# EasyEDA schematic H bridge core design.json
TITLE: H Bridge; REV: 1.0; Date: 2025-10-21; Sheet: 1/1; Drawn By: Sanmitra Goswami; Company: -
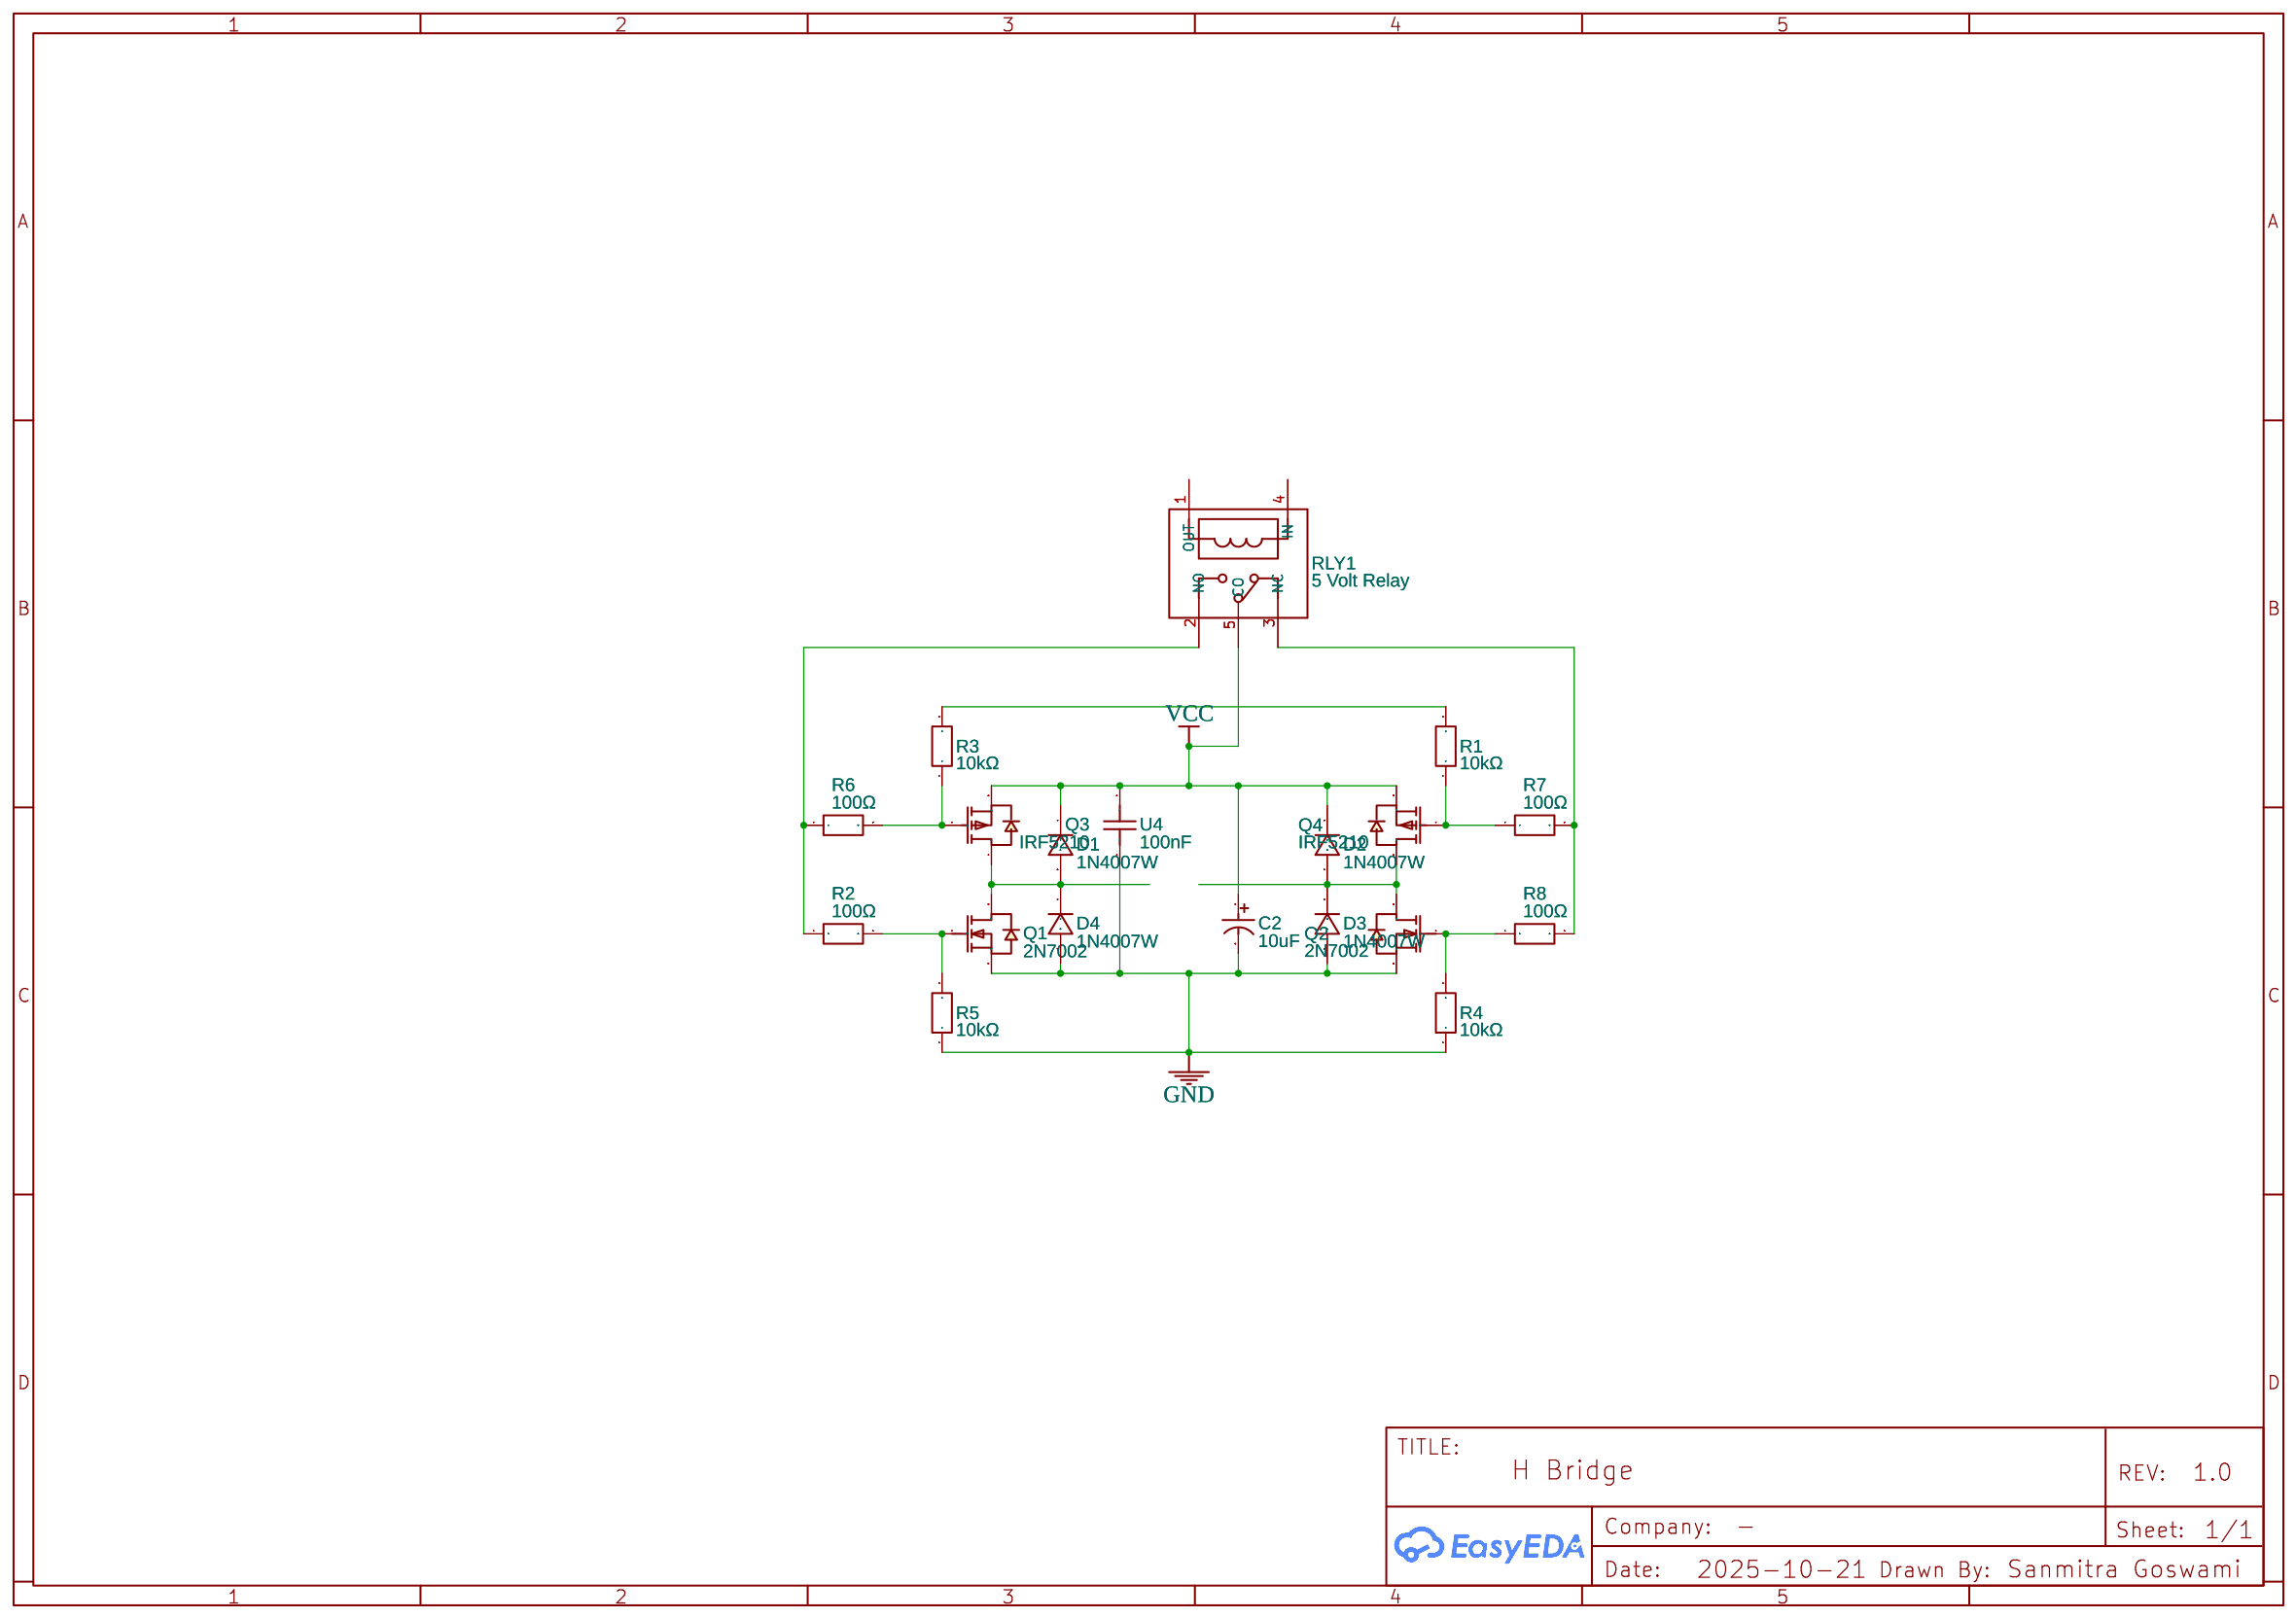
[diagram p0: schematic sheet]

## Parts
C2  10uF  [CAP-TH_BD4.0-P1.50-D0.8-FD]
D1  1N4007W  [SOD-123_L2.8-W1.8-LS3.7-RD]
D2  1N4007W  [SOD-123_L2.8-W1.8-LS3.7-RD]
D3  1N4007W  [SOD-123_L2.8-W1.8-LS3.7-RD]
D4  1N4007W  [SOD-123_L2.8-W1.8-LS3.7-RD]
Q1  2N7002  [SOT-23_L2.9-W1.3-P0.95-LS2.4-BR]
Q2  2N7002  [SOT-23_L2.9-W1.3-P0.95-LS2.4-BR]
Q3  IRF5210  [TO-263-2_L10.0-W9.1-P5.08-LS15.2-BR]
Q4  IRF5210  [TO-263-2_L10.0-W9.1-P5.08-LS15.2-BR]
R1  10kΩ  [R0603]
R2  100Ω  [R0603]
R3  10kΩ  [R0603]
R4  10kΩ  [R0603]
R5  10kΩ  [R0603]
R6  100Ω  [R0603]
R7  100Ω  [R0603]
R8  100Ω  [R0603]
RLY1  5 Volt Relay  [RELAY-TH_SRD-XXVDC-XL-C]
U4  100nF  [CAP-TH_L7.0-W3.5-P5.00-D0.6]

## Library data of the parts
C2 = electrolytic capacitor10UF50V: Supplier: LCSC; Manufacturer: Chengx(承兴); Manufacturer Part: KS106M050C07RR0VH2FP0; Supplier Part: C32856; JLCPCB Part Class: Extended Part
D1-D4 = 1N4007W: Supplier: LCSC; Supplier Part: C328592; Manufacturer: BLUE ROCKET; Contributor: LCEDA_Lib
Q1 Q2 = 2N7002: Supplier: LCSC; Manufacturer: Nexperia; Manufacturer Part: 2N7002,215; image: //image.lceda.cn/szlcsc/C65189.jpg; Supplier Part: C65189; Paste Type: expand; Contributor: LCEDA_Lib
Q3 Q4 = IRF5210: Supplier: LCSC; Manufacturer: IR; Manufacturer Part: IRF5210STRLPBF; image: //image.lceda.cn/szlcsc/C2622.jpg; Supplier Part: C2622; Paste Type: expand; Contributor: LCEDA_Lib
R1 R3-R5 = TD03H1002BT: Contributor: lcsc; Supplier: LCSC; Supplier Part: C2961367; Manufacturer: FH(风华); JLCPCB Part Class: Extended Part
R2 R6-R8 = 0603 ±5% 100Ω: Contributor: lcsc; Supplier: LCSC; Supplier Part: C2889393; Manufacturer: VO(翔胜); JLCPCB Part Class: Extended Part
RLY1 = 5 Volt Relay: Supplier: LCSC; Manufacturer: 松乐; Manufacturer Part: 5 Volt Relay mp; Supplier Part: C35449; JLCPCB Part Class: Extended Part; Contributor: fahmiahmadassidik
U4 = B32559C3104K000: Contributor: lcsc; Supplier: LCSC; Supplier Part: C3769950; Manufacturer: TDK

## Nets
GND: C2.2(-) D3.2 D4.2 Q1.2(S) Q2.2(S) R4.1 R5.1 U4.1
VCC: C2.1(+) D1.1 D2.1 Q3.3(S) Q4.3(S) RLY1.5(CO) U4.2
Net-(D1-2): D1.2 D4.1 Q1.3(D) Q3.4(D)
Net-(D2-2): D2.2 D3.1 Q2.3(D) Q4.4(D)
Net-(Q1-1): Q1.1(G) R2.2 R5.2
Net-(Q2-1): Q2.1(G) R4.2 R8.1
Net-(Q3-1): Q3.1(G) R3.1 R6.2
Net-(Q4-1): Q4.1(G) R1.1 R7.1
Net-(R1-2): R1.2 R3.2
Net-(R2-1): R2.1 R6.1 RLY1.2(NO)
Net-(R7-2): R7.2 R8.2 RLY1.3(NC)

Not connected (* = marked no-connect by the designer): RLY1 1(OUT) 4(IN)
